# EAGLE design Bears_and_Bears_BLE_soil_Moisture_Sensor (EAGLE 9.1.0)

## Sheet 1 of 2
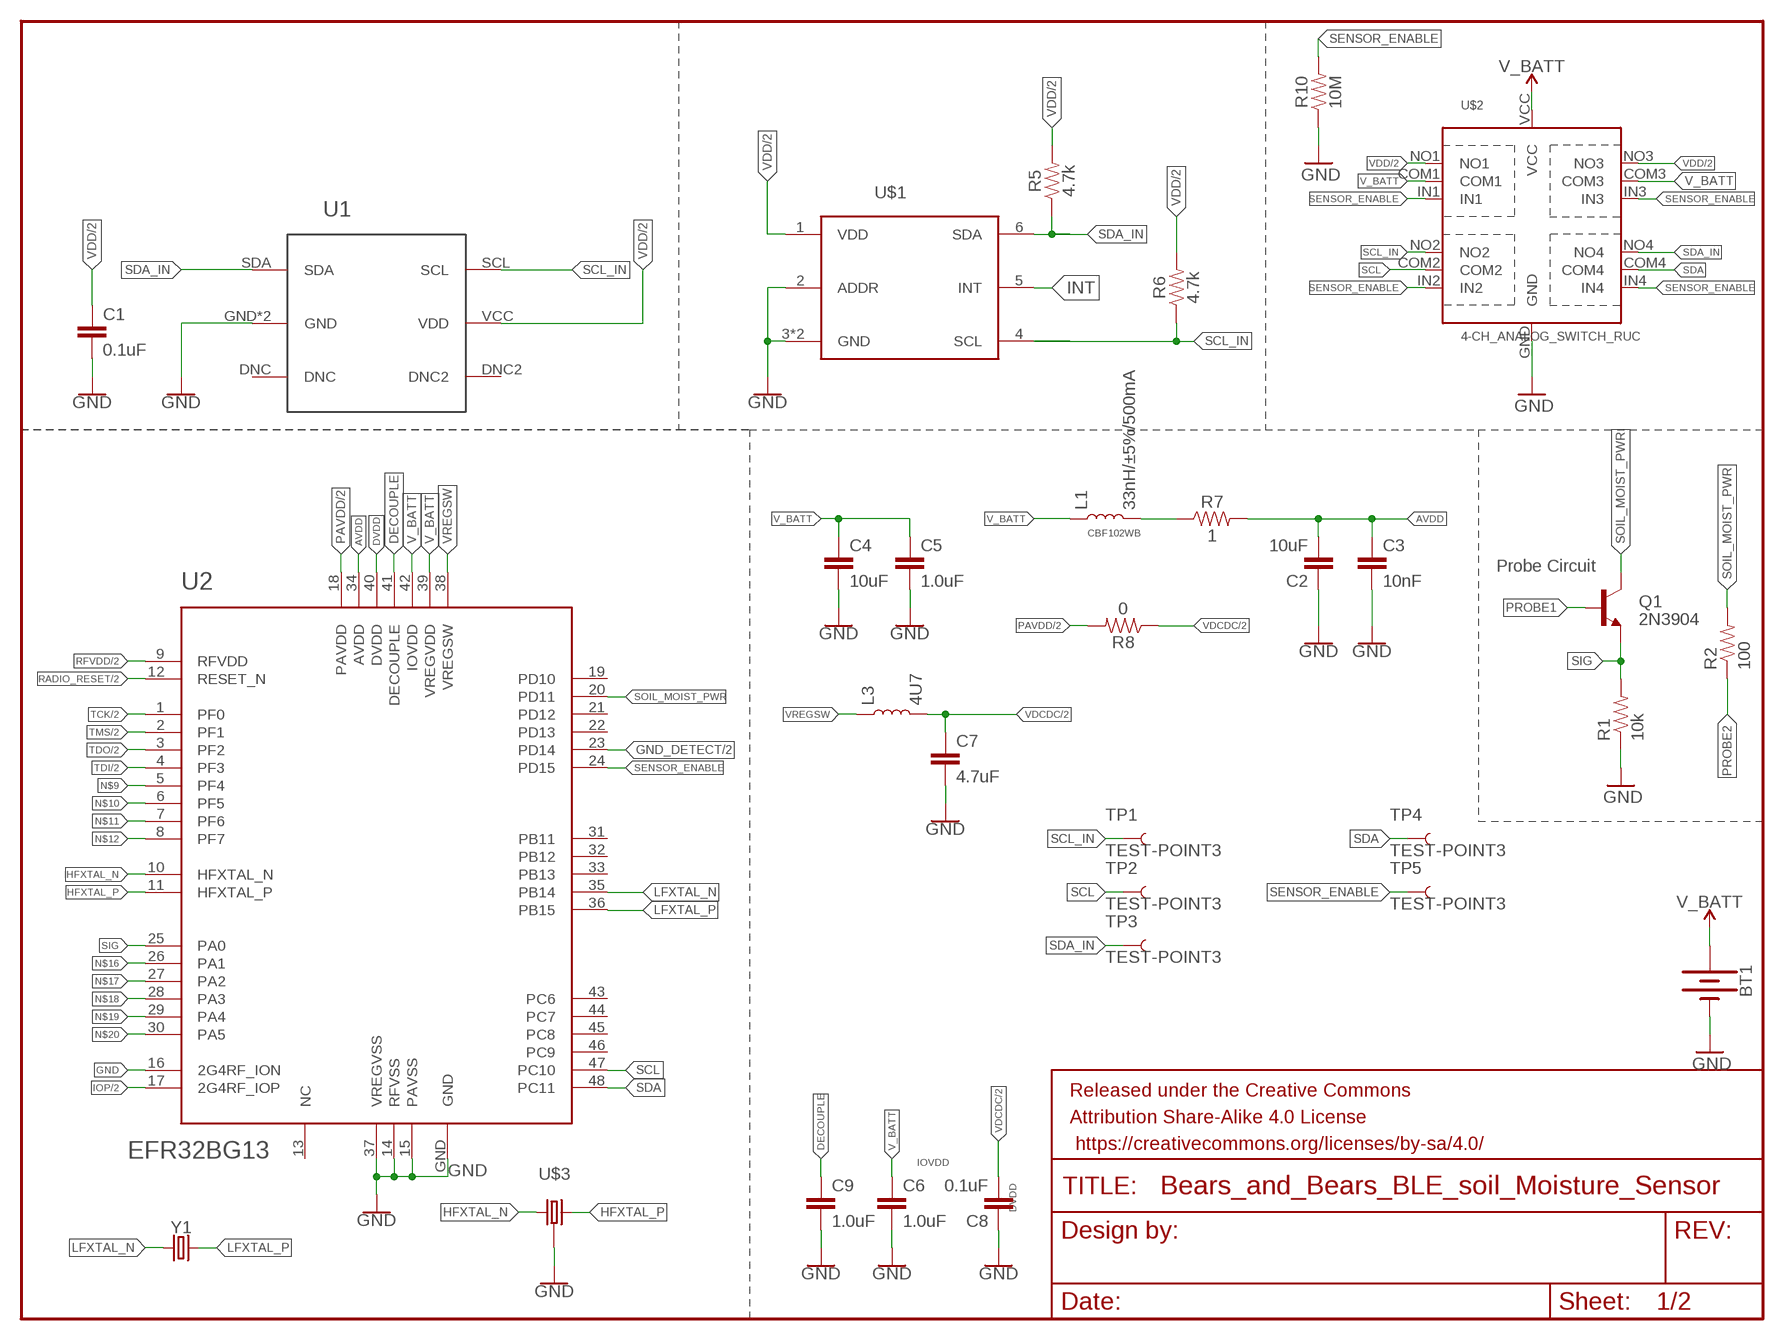
[diagram p0: schematic, sheet 1]

### Parts
BT1  BATTERY-20MM_SMD_4LEGS_OVERPASTE  [BATTCON_20MM_4LEGS_OVERPASTE]
C1  0.1uF  0.1UF-0603-25V-(+80/-20%)  [0603]
C2  10uF  10UF-0603-6.3V-20%  [0603]
C3  10nF  10NF-0603-50V-10%  [0603]
C4  10uF  10UF-0603-6.3V-20%  [0603]
C5  1.0uF  1.0UF-0603-16V-10%  [0603]
C6  1.0uF  1.0UF-0603-16V-10%  [0603]
C7  4.7uF  4.7UF0603  [0603]
C8  0.1uF  0.1UF-0603-25V-(+80/-20%)  [0603]
C9  1.0uF  1.0UF-0603-16V-10%  [0603]
FRAME1  FRAME-LETTER  [CREATIVE_COMMONS]
L1  33nH/±5%/500mA  INDUCTOR-0603-33NH  [0603]
L3  4U7  [1212(3030METRIC)]
Q1  2N3904  TRANSISTOR_NPNMMBT2222A  [SOT23-3]
R1  10k  100OHM-1/4W-5%(0603)  [0603-RES]
R2  100  100OHM-1/4W-5%(0603)  [0603-RES]
R5  4.7k  4.7KOHM-0603-1/10W-1%  [0603]
R6  4.7k  4.7KOHM-0603-1/10W-1%  [0603]
R7  1  1OHM-0603-1/10W-1%  [0603]
R8  0  0OHM-0603-1/10W-5%  [0603]
R10  10M  10MOHM-0603-1/10W-5%  [0603]
TP1  TEST-POINT3  [PAD.03X.03]
TP2  TEST-POINT3  [PAD.03X.03]
TP3  TEST-POINT3  [PAD.03X.03]
TP4  TEST-POINT3  [PAD.03X.03]
TP5  TEST-POINT3  [PAD.03X.03]
U1  SI7021_TEMP_HUMIDTY  [DFN-6]
U2  EFR32BG13  [QFN48]
U$1  OPT3001DNPT  [6PIN_USON]
U$2  4-CH_ANALOG_SWITCH_RUC  [PX2QFN14_RUC]
U$3  38.4MHZ_CRYSTAL  [2.0X1.6]
Y1  32.768KHZ_LOW_FREQ_CRYSTAL  [CRYSTAL_1.2X0.6]

### Nets
AVDD: C2.2 C3.1 R7.2 U2.34(AVDD)
DECOUPLE: C9.1 U2.41(DECOUPLE)
DVDD: U2.40(DVDD)
GND: BT1.2(-) C1.2 C2.1 C3.2 C4.2 C5.2 C6.2 C7.2 C8.1 C9.2 R1.1 R10.1 U1.GND U1.GND2(GND) U2.14(RFVSS) U2.15(PAVSS) U2.16(2G4RF_ION) U2.37(VREGVSS) U2.GND U$1.2(ADDR) U$1.3(GND) U$1.GND U$2.GND U$3.GND U$3.GND2(GND) ; also sheet 2
GND_DETECT: U2.23(PD14) ; also sheet 2
HFXTAL_N: U2.10(HFXTAL_N) U$3.1
HFXTAL_P: U2.11(HFXTAL_P) U$3.3
INT: U$1.5(INT)
IOP: U2.17(2G4RF_IOP) ; also sheet 2
LFXTAL_N: U2.35(PB14) Y1.P$1
LFXTAL_P: U2.36(PB15) Y1.P$2
N$9: U2.5(PF4)
N$10: U2.6(PF5)
N$11: U2.7(PF6)
N$12: U2.8(PF7)
N$16: U2.26(PA1)
N$17: U2.27(PA2)
N$18: U2.28(PA3)
N$19: U2.29(PA4)
N$20: U2.30(PA5)
N$49: L1.2 R7.1
PAVDD: R8.2 U2.18(PAVDD) ; also sheet 2
PROBE1: Q1.1(B)
PROBE2: R2.1
RADIO_RESET: U2.12(RESET_N) ; also sheet 2
RFVDD: U2.9(RFVDD) ; also sheet 2
SCL: TP2.P$1 U2.47(PC10) U$2.COM2
SCL_IN: R6.1 TP1.P$1 U1.SCL U$1.4(SCL) U$2.NO2
SDA: TP4.P$1 U2.48(PC11) U$2.COM4
SDA_IN: R5.1 TP3.P$1 U1.SDA U$1.6(SDA) U$2.NO4
SENSOR_ENABLE: R10.2 TP5.P$1 U2.24(PD15) U$2.IN1 U$2.IN2 U$2.IN3 U$2.IN4
SIG: Q1.2(E) R1.2 U2.25(PA0)
SOIL_MOIST_PWR: Q1.3(C) R2.2 U2.20(PD11)
TCK: U2.1(PF0) ; also sheet 2
TDI: U2.4(PF3) ; also sheet 2
TDO: U2.3(PF2) ; also sheet 2
TMS: U2.2(PF1) ; also sheet 2
V_BATT: BT1.1(+) C4.1 C5.1 C6.1 L1.1 U2.39(VREGVDD) U2.42(IOVDD) U$2.COM1 U$2.COM3 U$2.VCC
VDCDC: C7.1 C8.2 L3.P$2 R8.1 ; also sheet 2
VDD: C1.1 R5.2 R6.2 U1.VCC(VDD) U$1.1(VDD) U$2.NO1 U$2.NO3 ; also sheet 2
VREGSW: L3.P$1 U2.38(VREGSW)
Unconnected: U1.DNC U1.DNC2 U2.13(NC) U2.19(PD10) U2.21(PD12) U2.22(PD13) U2.31(PB11) U2.32(PB12) U2.33(PB13) U2.43(PC6) U2.44(PC7) U2.45(PC8) U2.46(PC9)

### Notes on the sheet
- CBF102WB
- Probe Circuit
- IOVDD
- DVDD

## Sheet 2 of 2
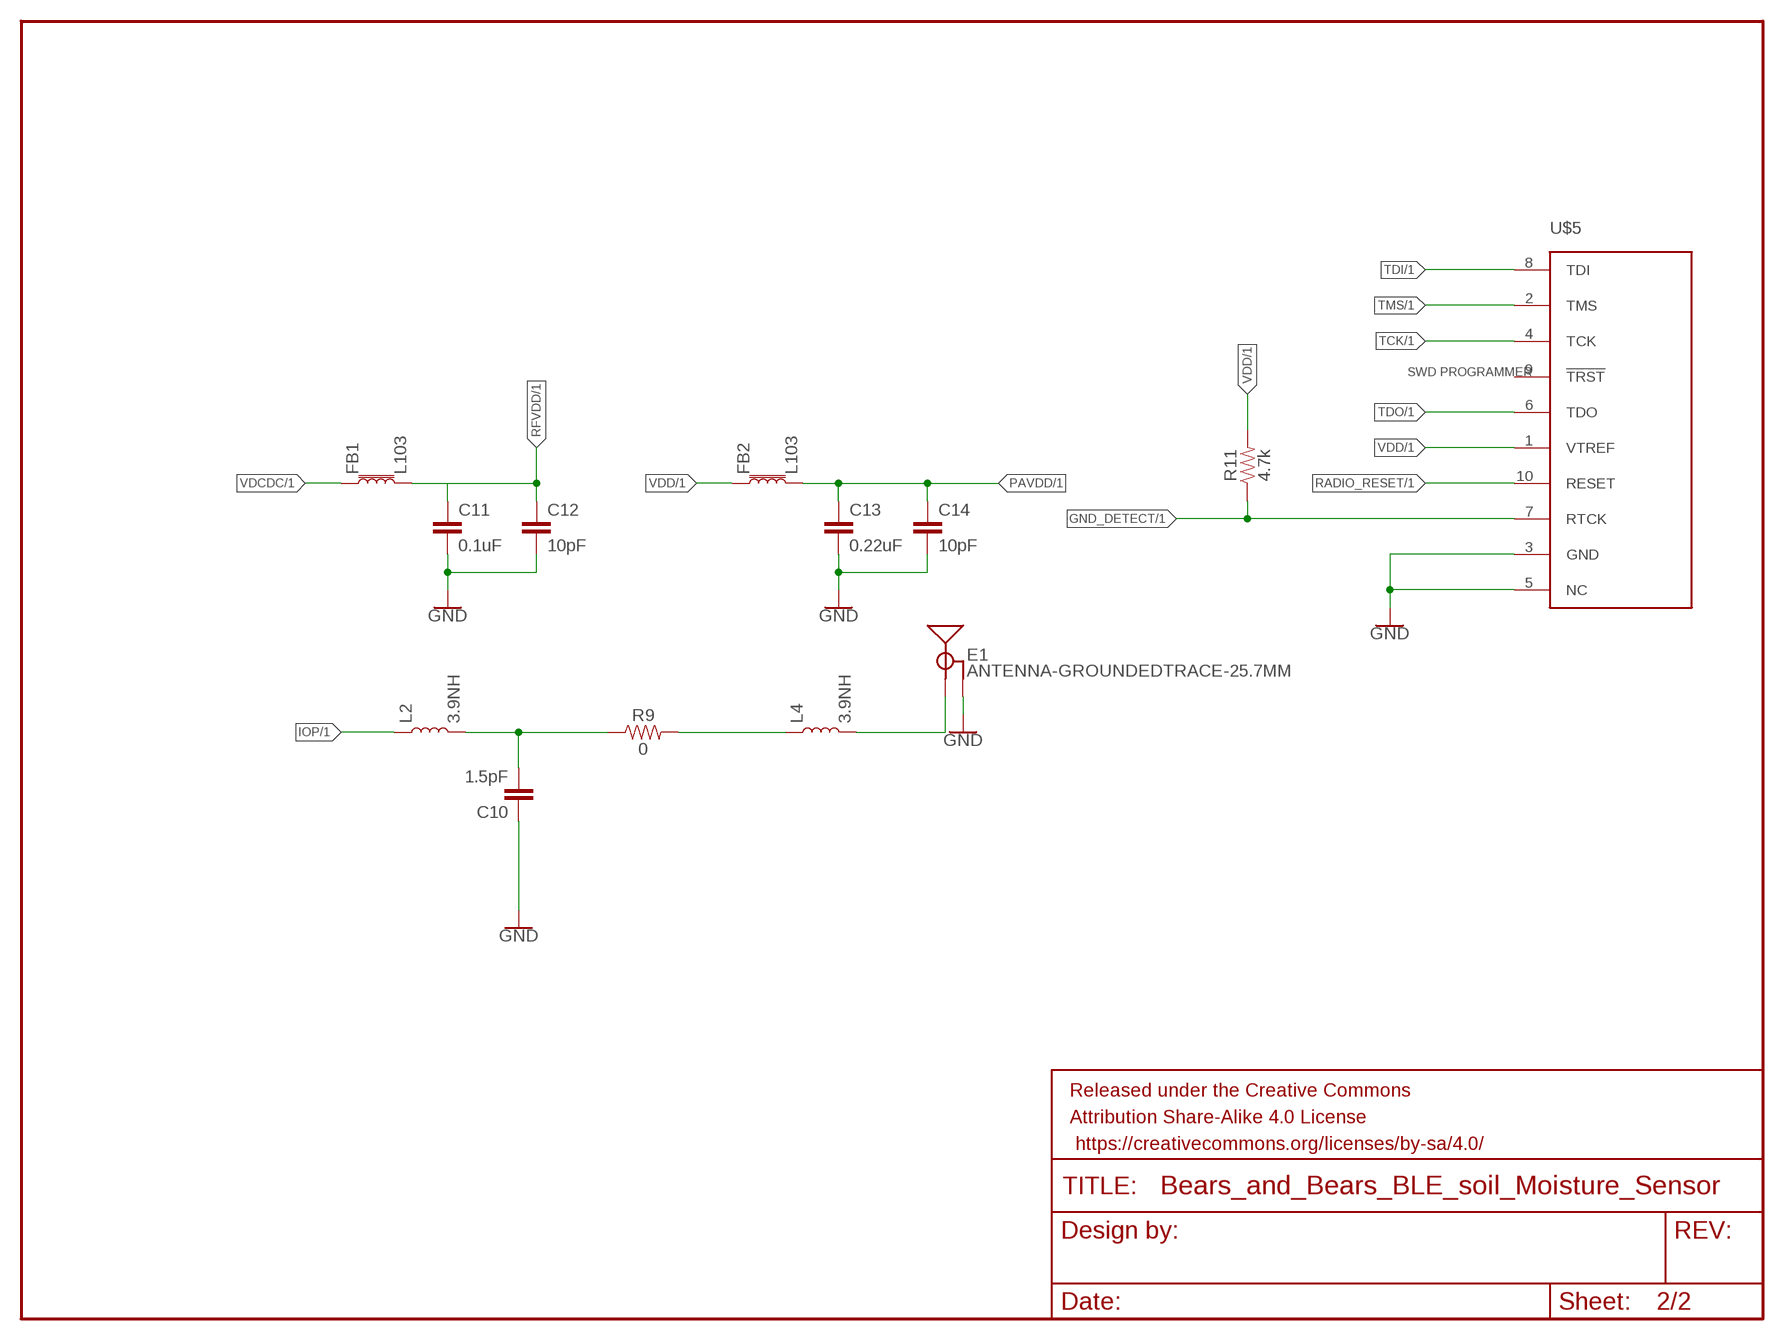
[diagram p1: schematic, sheet 2]

### Parts
C10  1.5pF  1.5PF-0603-50V-16.667%  [0603]
C11  0.1uF  0.1UF-0603-25V-(+80/-20%)  [0603]
C12  10pF  10PF-0603-50V-5%  [0603]
C13  0.22uF  0.22UF-0603-25V-10%  [0603]
C14  10pF  10PF-0603-50V-5%  [0603]
E1  ANTENNA-GROUNDEDTRACE-25.7MM  [TRACE_ANTENNA_2.4GHZ_25.7MM]
FB1  L103  FERRITE_BEAD-0603  [0603]
FB2  L103  FERRITE_BEAD-0603  [0603]
FRAME2  FRAME-LETTER  [CREATIVE_COMMONS]
L2  3.9NH  INDUCTOR-0402-3.9NH  [0402]
L4  3.9NH  INDUCTOR-0402-3.9NH  [0402]
R9  0  0.22OHM-0805-1/4W-1%  [0805]
R11  4.7k  4.7KOHM-0603-1/10W-1%  [0603]
U$5  TC2050-MCP-NL  [TC2030-MCP-NL]

### Nets
GND: C10.1 C11.2 C12.2 C13.2 C14.2 E1.GND E1.GND2(GND) U$5.3(GND) U$5.5(NC) ; also sheet 1
GND_DETECT: R11.1 U$5.7(RTCK) ; also sheet 1
IOP: L2.1 ; also sheet 1
N$3: C10.2 L2.2 R9.1
N$23: L4.1 R9.2
N$26: E1.ANT(SIGNAL) L4.2
PAVDD: C13.1 C14.1 FB2.2 ; also sheet 1
RADIO_RESET: U$5.10(RESET) ; also sheet 1
RFVDD: C11.1 C12.1 FB1.2 ; also sheet 1
TCK: U$5.4(TCK) ; also sheet 1
TDI: U$5.8(TDI) ; also sheet 1
TDO: U$5.6(TDO) ; also sheet 1
TMS: U$5.2(TMS) ; also sheet 1
VDCDC: FB1.1 ; also sheet 1
VDD: FB2.1 R11.2 U$5.1(VTREF) ; also sheet 1
Unconnected: U$5.9(!TRST)

### Notes on the sheet
- SWD PROGRAMMER

## Library data of the parts
BT1 = SparkFun-Batteries:BATTERY: Battery - Single Cell A variety of battery chemistries, sizes, and footprints. Device List: 20MM_PTH - Coin Cell Battery Holder - 20mm (PTH) <https://www.sparkfun.com/products/783> 6.8MM_PTH - Coin Cell Battery Holder - 6.8MM(SMD) <https://www.digikey.com/product-detail/en/seiko-instruments/MS621FE-FL11E/728-1057-ND/1889208?WT.srch=1&gclid=CNOQ5a6LzdQCFZS2wAodXCkE0g> 12MM_SMD - Coin Cell Battery Holder - 12mm (SMD) <https://www.sparkfun.com/products/10592> 12MM_PTH - Coin Cell Battery Holder - 12mm (PTH) <https://www.sparkfun.com/products/7948> 20MM_SMD - 20mm Coin Cell Battery Holder (SMD) (2 legs) Used on the Big Time Watch Kit <https://www.sparkfun.com/products/11734> 20MM_SMD_4LEGS - Coin Cell Battery Holder - 20mm (SMD) <https://www.sparkfun.com/products/11892> 20MM_SMD_4LEGS_OVERPASTE - Coin Cell Battery Holder - 20mm (SMD) <https://www.sparkfun.com/products/11892> (Over-paste on the legs) 24.5MM_PTH - Coin Cell Battery Holder - 24.5mm (PTH) <https://www.sparkfun.com/products/8863> 9V - 9V Battery Holder - PC Mount Used on the SparkFun SparkPunk Sound Kit <https://www.sparkfun.com/products/11177> and SparkFun SparkPunk Sequencer Kit <https://www.sparkfun.com/products/12707> 18650 - Battery Holder - 18650 (PTH) <https://www.sparkfun.com/products/13113> AA - Battery Holder - 1xAA (PTH) <https://www.sparkfun.com/products/7949> AAA - Battery Holder - 1xAAA (PTH) <https://www.sparkfun.com/products/12718> AA_KIT - Battery Holder - 1xAA (PTH) <https://www.sparkfun.com/products/7949> Special kit package - pads only have exposed copper on one side of the board. AAA_KIT - Battery Holder - 1xAAA (PTH) <https://www.sparkfun.com/products/12718> Special kit package - pads only have exposed copper on one side of the board.; PROD_ID: PRT-11892; SF_SKU: BATT-10373
C1 C8 C11 = SparkFun-Capacitors:0.1UF: 0.1µF ceramic capacitors A capacitor is a passive two-terminal electrical component used to store electrical energy temporarily in an electric field.; PROD_ID: CAP-00810
C2 C4 = SparkFun-Capacitors:10UF: 10.0µF ceramic capacitors A capacitor is a passive two-terminal electrical component used to store electrical energy temporarily in an electric field.; PROD_ID: CAP-11015
C3 = SparkFun-Capacitors:10NF: 0.01uF/10nF/10,000pF ceramic capacitors A capacitor is a passive two-terminal electrical component used to store electrical energy temporarily in an electric field. CAP-09321; PROD_ID: CAP-00867
C5 C6 C9 = SparkFun-Capacitors:1.0UF: 1µF ceramic capacitors A capacitor is a passive two-terminal electrical component used to store electrical energy temporarily in an electric field.; PROD_ID: CAP-00868
C7 = SparkFun-Capacitors:4.7UF: 4.7µF ceramic capacitors A capacitor is a passive two-terminal electrical component used to store electrical energy temporarily in an electric field.; PROD_ID: CAP-08280
C10 = SparkFun-Capacitors:1.5PF: 1.5pF ceramic capacitors A capacitor is a passive two-terminal electrical component used to store electrical energy temporarily in an electric field.; PROD_ID: CAP-08763
C12 C14 = SparkFun-Capacitors:10PF: 10pF ceramic capacitors A capacitor is a passive two-terminal electrical component used to store electrical energy temporarily in an electric field.; PROD_ID: CAP-11812
C13 = SparkFun-Capacitors:0.22UF: 0.22µF ceramic capacitors A capacitor is a passive two-terminal electrical component used to store electrical energy temporarily in an electric field.; PROD_ID: CAP-07822
E1 = SparkFun-RF:ANTENNA-GROUNDED: Antenna w/ Ground Connection 2.4GHz antennae with signal and ground terminals. TRACE_ANTENNA_2.4GHZ_15.2MM - Meander Trace antenna 15.2 x 5.7mm footprint Based on layout from TI app note AN043 <http://www.ti.com/lit/an/swra117d/swra117d.pdf>. TRACE_ANTENNA_2.4GHZ_25.7MM - Inverted F trace antenna 25.7 x 7.5 mm footprint. Based on layout from TI design note DN0007 <http://www.ti.com/lit/an/swru120b/swru120b.pdf>.
FB1 FB2 = SparkFun-Coils:FERRITE_BEAD: Ferrite Bead (blocks, cores, rings, chokes, etc.) Inductor with layers of ferrite used to suppress high frequencies. Often used to isolate high frequency noise. SparkFun Products: IOIO-OTG - V2.2 <https://www.sparkfun.com/products/13613> SparkFun SAMD21 Mini Breakout <https://www.sparkfun.com/products/13664> SparkFun 6 Degrees of Freedom Breakout - LSM6DS3 <https://www.sparkfun.com/products/13339> SparkFun SAMD21 Dev Breakout <https://www.sparkfun.com/products/13672>; PROD_ID: NDUC-13805; VALUE: 30Ω/1.8A
FRAME1 FRAME2 = SparkFun-Aesthetics:FRAME-LETTER: Schematic Frame - Letter Standard 8.5x11 US Letter frame
L1 = SparkFun-Coils:INDUCTOR: Inductors Resist changes in electrical current. Basically a coil of wire. SparkFun Products: SparkFun Load Cell Amplifier - HX711 <https://www.sparkfun.com/products/13879> IOIO-OTG - V2.2 <https://www.sparkfun.com/products/13613>; PROD_ID: NDUC-07874
L2 L4 = SparkFun-Coils:INDUCTOR: Inductors Resist changes in electrical current. Basically a coil of wire. SparkFun Products: SparkFun Load Cell Amplifier - HX711 <https://www.sparkfun.com/products/13879> IOIO-OTG - V2.2 <https://www.sparkfun.com/products/13613>; PROD_ID: NDUC-13457
L3 = 4.7UH:4U7
Q1 = SparkFun-DiscreteSemi:TRANSISTOR_NPN: Generic NPN BJT MMBT2222A - TRANS-08049 (SOT-23, 1A 40V) MPSA42 - TRANS-09116 (SOT-23, 500mA 300V) MMBT5088LT1G - TRANS-11160 (SOT-23, 50 mA 30V) BC547 - COM-08928 <http://www.sparkfun.com/products/8928> (TO-92 45V 100mA) (1.Collector 2.Base 3.Emitter) 2N3904 - COM-00521 <http://www.sparkfun.com/products/521> (TO-92 40V 200mA) (1.Emitter 2.Base 3.Collector) P2N2222A - COM-12852 <http://www.sparkfun.com/products/12852> (TO-92 40V 600mA) (1.Collector 2.Base 3.Emitter); PROD_ID: TRANS-08049; VALUE: MMBT2222A
R1 R2 = SparkFun-Resistors:100OHM-1/4W-5%(0603); PROD_ID: RES-12438; VALUE: 100/.25W
R5 R6 R11 = SparkFun-Resistors:4.7KOHM: 4.7kΩ resistor A resistor is a passive two-terminal electrical component that implements electrical resistance as a circuit element. Resistors act to reduce current flow, and, at the same time, act to lower voltage levels within circuits. - Wikipedia; PROD_ID: RES-07857
R7 = SparkFun-Resistors:1OHM: 1Ω resistor A resistor is a passive two-terminal electrical component that implements electrical resistance as a circuit element. Resistors act to reduce current flow, and, at the same time, act to lower voltage levels within circuits. - Wikipedia; PROD_ID: RES-08269
R8 = SparkFun-Resistors:0OHM: 0Ω resistor A resistor is a passive two-terminal electrical component that implements electrical resistance as a circuit element. Resistors act to reduce current flow, and, at the same time, act to lower voltage levels within circuits. - Wikipedia; PROD_ID: RES-08609
R9 = SparkFun-Resistors:0.22OHM: 0.22Ω resistor A resistor is a passive two-terminal electrical component that implements electrical resistance as a circuit element. Resistors act to reduce current flow, and, at the same time, act to lower voltage levels within circuits. - Wikipedia; PROD_ID: RES-09883; VALUE: 0.22
R10 = SparkFun-Resistors:10MOHM: RES-09327; PROD_ID: RES-08283
TP1-TP5 = SparkFun-Connectors:TEST-POINT: SparkFun Test Points Bare copper test points for troubleshooting or In-Circuit-Testing. These are used by our Production team for verifying production board runs using pogo-pins on test beds. SparkFun Products: SparkFun LSM9DS1 Breakout <https://www.sparkfun.com/products/13284> SparkFun PSOC <https://www.sparkfun.com/products/13714> SparkFun Load Cell Amplifier <https://www.sparkfun.com/products/13879>
U1 = Si7021_A20:SI7021_TEMP_HUMIDTY
U2 = EFR32BG13:EFR32BG13
U$1 = ALS_OPT3001:OPT3001DNPT
U$2 = 4chAnalogSwitch:4-CH_ANALOG_SWITCH_RUC
U$3 = Crystal_SMD_2.0x1.6:38.4MHZ_CRYSTAL
U$5 = TC2050:TC2050: TAG-CONNECT ISP Connector Manufacturer: Tag-Connect <www.tag-connect.com> Cable for easy In-Circuit PCB Programming. Designed for JTAG 10 pin, suitable for many others. Pin Connection for TC2050 NL. PAD Description 1 VTREF 2 TMS 3 GND 4 TCK 5 NC 6 TDO 7 RTCK 8 TDI 9 !TRST 10 RESET ©2009 ROFA.cz Modified 7/2011 by Tim McCarthy-Smith VIDA Products INC
Y1 = Crystal_SMD_1.2x0.6:32.768KHZ_LOW_FREQ_CRYSTAL

## Board
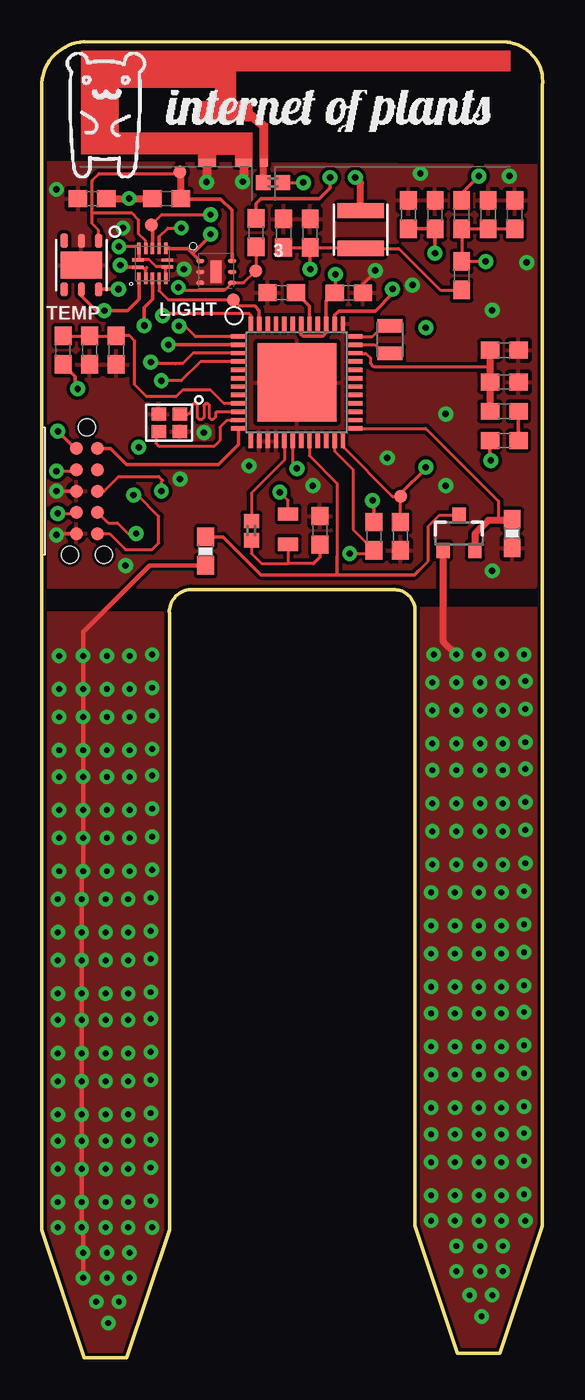
[diagram p2: board, top side]
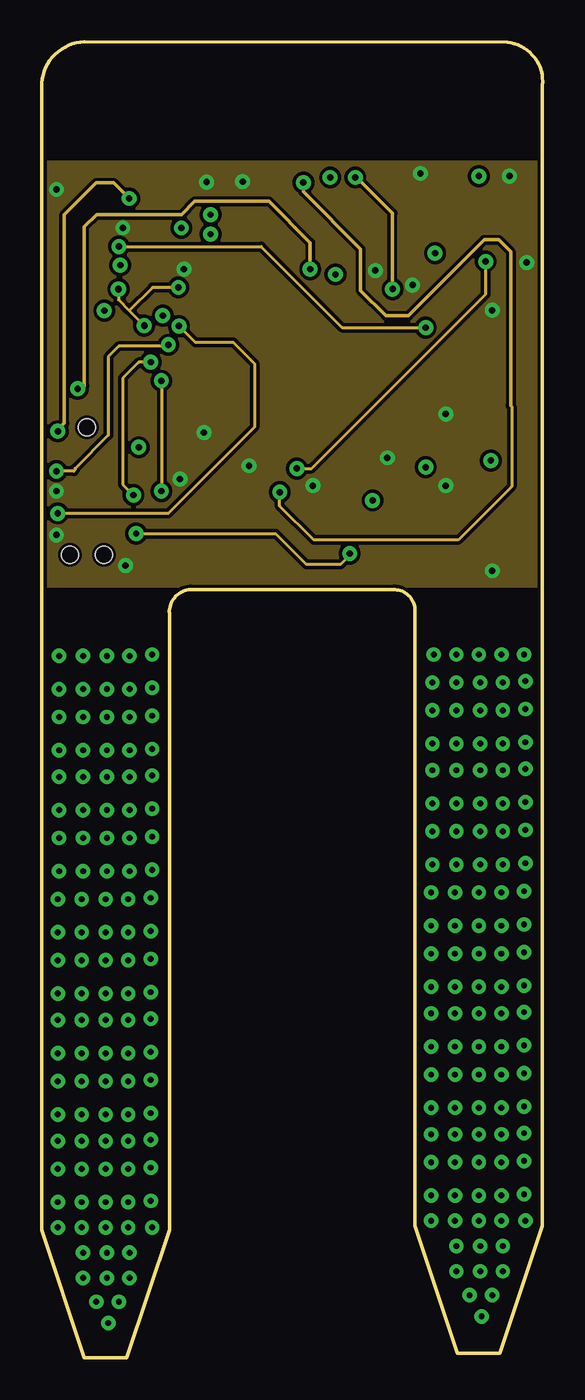
[diagram p3: board, inner layer Route2]
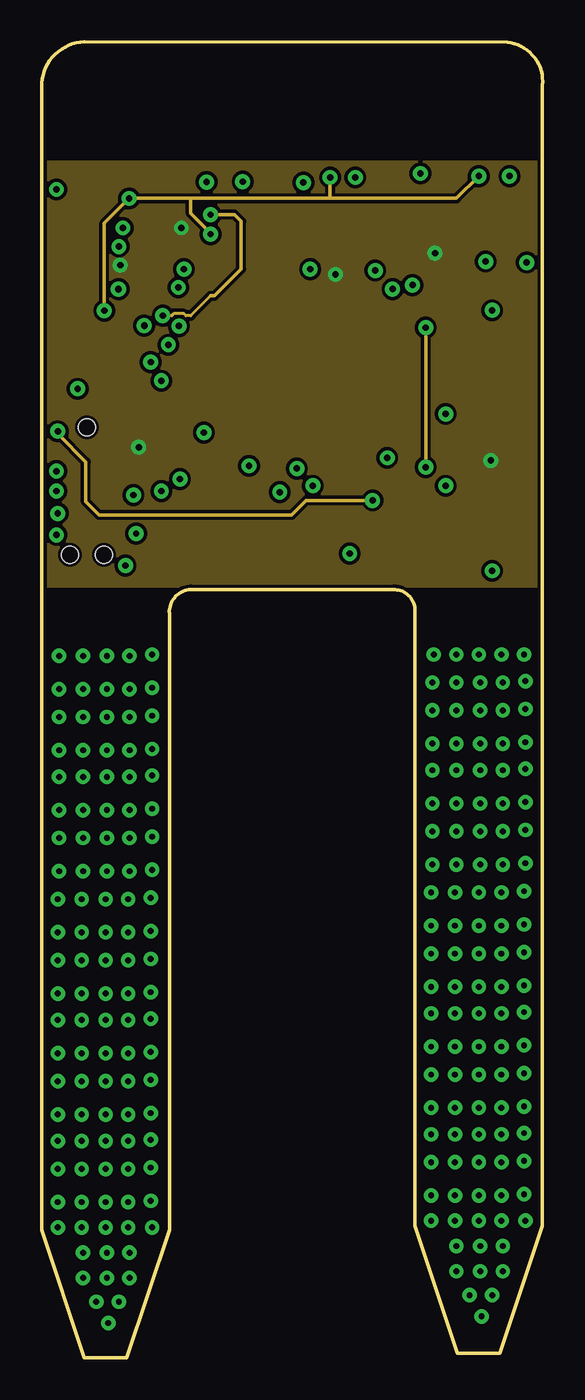
[diagram p4: board, inner layer Route15]
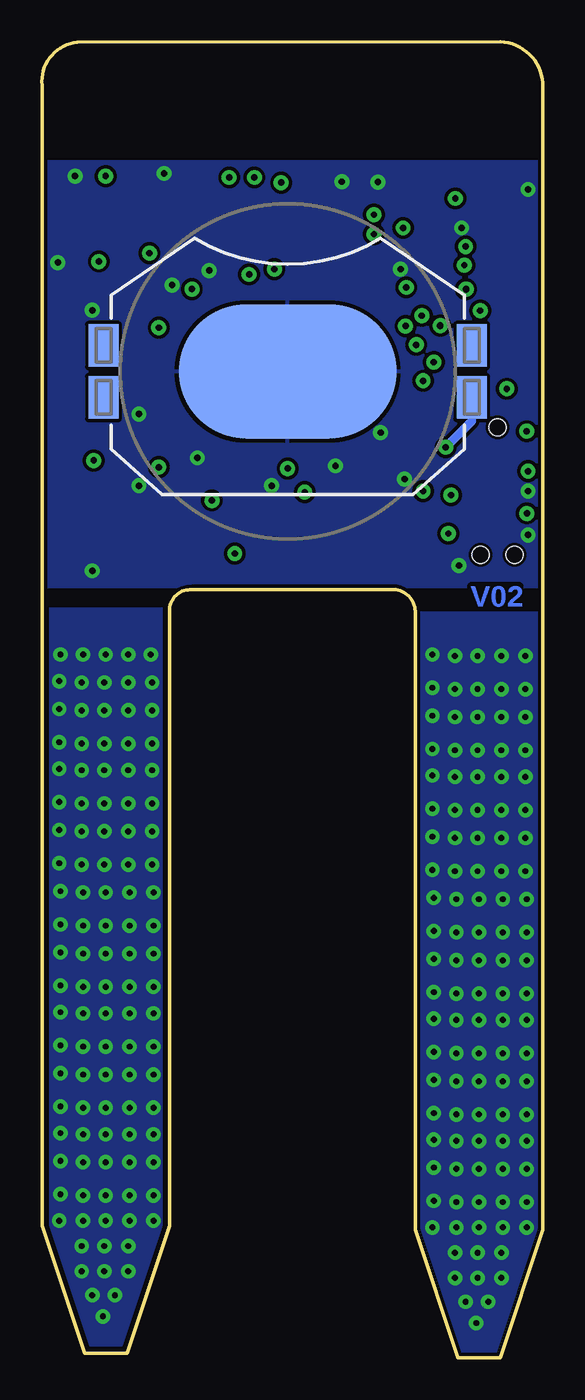
[diagram p5: board, bottom side, seen from below]

Size 29.93 x 78.58 mm. Coordinates in mm from the lower left corner, seen from the top.
Outline: 2.54,78.58 arc90 0,75.88 0,7.62 2.54,0 5.08,0 7.62,7.62 7.62,44.45 arc-90 8.89,45.88 20.97,45.86 arc-90 22.3,44.72 22.3,7.89 24.84,0.27 27.38,0.27 29.92,7.89 29.92,75.99 arc90 27.8,78.56 2.54,78.58
Copper layers (1*2*15*16): Top 0.035559375mm / dielectric 0.47751875mm / Route2 0.035559375mm / dielectric 0.47751875mm / Route15 0.035559375mm / dielectric 0.47751875mm / Bottom 0.035559375mm
Design rules "SparkFun-2-layer *": minimum track width 7mil, minimum drill 15mil, track to track 8mil, track to pad 8mil, pad to pad 8mil, via to via 8mil, smd to smd 8mil, copper to edge 8mil, drill to drill 8mil, minimum pad ring 12mil, minimum via ring 10mil, stop-mask expansion 4mil, vias tented up to drill 20mil, thermal gap 10mil

### Footprints (pad centres in the part's own frame; a part is rotated, then mirrored left to right if it is on the bottom)
BATTCON_20MM_4LEGS_OVERPASTE = smd 1.778 x 2.54: 1 -11,1.55; 3 11,1.55; P$1 -11,-1.55; P$2 11,-1.55 | smd 13 x 8: 2 0,0
0603 = smd 1.1 x 1: 1 -0.85,0; 2 0.85,0
TRACE_ANTENNA_2.4GHZ_25.7MM = smd 0.46 x 0.46: ANT 0,0.23 | smd 1 x 0.46: GND -1.18,0.23; GND2 -3.38,0.23
0402 = smd 0.85 x 0.9: 1 -0.58,0; 2 0.58,0
1212(3030METRIC) = smd 0.9 x 2.8: P$1 -1.025,0; P$2 1.225,0
SOT23-3 = smd 0.8 x 0.9: 1 -0.95,-1; 2 0.95,-1; 3 0,1.1
0603-RES = smd 1.1 x 1: 1 -0.85,0; 2 0.85,0
0805 = smd 0.8 x 1.2: 1 -0.9,0; 2 0.9,0
PAD.03X.03 = smd 0.762 x 0.762: P$1 0,0
DFN-6 = smd 0.85 x 0.45: DNC -1.462,-1.023; DNC2 1.438,-1.023; GND2 -1.45,0; SCL 1.442,1.027; SDA -1.45,1.024; VCC 1.444,0.003 | smd 1.6 x 2.5: GND 0,0
QFN48 = smd 0.86 x 0.26: 1 -3.5,4; 2 -3.5,3.5; 3 -3.5,3; 4 -3.5,2.5; 5 -3.5,2; 6 -3.5,1.5; 7 -3.5,1; 8 -3.5,0.5; 9 -3.5,0; 10 -3.5,-0.5; 11 -3.5,-1; 12 -3.5,-1.5; 25 3.5,-1.5; 26 3.5,-1; 27 3.5,-0.5; 28 3.5,0; 29 3.5,0.5; 30 3.5,1; 31 3.5,1.5; 32 3.5,2; 33 3.5,2.5; 34 3.5,3; 35 3.5,3.5; 36 3.5,4 | smd 0.26 x 0.86: 13 -2.75,-2.25; 14 -2.25,-2.25; 15 -1.75,-2.25; 16 -1.25,-2.25; 17 -0.75,-2.25; 18 -0.25,-2.25; 19 0.25,-2.25; 20 0.75,-2.25; 21 1.25,-2.25; 22 1.75,-2.25; 23 2.25,-2.25; 24 2.75,-2.25; 37 2.75,4.75; 38 2.25,4.75; 39 1.75,4.75; 40 1.25,4.75; 41 0.75,4.75; 42 0.25,4.75; 43 -0.25,4.75; 44 -0.75,4.75; 45 -1.25,4.75; 46 -1.75,4.75; 47 -2.25,4.75; 48 -2.75,4.75 | smd 4.7 x 4.7: GND 0,1.25
6PIN_USON = smd 0.5 x 0.25: 1 0.1,1.625; 2 0.1,0.975; 3 0.1,0.325; 4 2,0.325; 5 2,0.975; 6 2,1.625 | smd 0.65 x 1.35: GND 1.05,0.975
PX2QFN14_RUC = smd 0.2 x 0.68: COM1 0.65,0.15; COM2 1.45,0.15; COM3 1.45,1.95; COM4 1.05,1.95; IN2 1.85,0.15; IN4 0.25,1.95; NO1 0.25,0.15; NO2 1.05,0.15; NO3 1.85,1.95; NO4 0.65,1.95 | smd 0.68 x 0.2: GND 1.95,1.25; IN1 0.175,1.275; IN3 1.95,0.85; VCC 0.175,0.825
2.0X1.6 = smd 0.875 x 0.775: 1 1.26,0; 3 0,-1.04; GND 0,0; GND2 1.26,-1.04
TC2030-MCP-NL = smd 0.787 x 0.787: 1 1.27,-0.635; 2 2.54,-0.635; 3 3.81,-0.635; 4 5.08,-0.635; 5 6.35,-0.635; 6 6.35,0.635; 7 5.08,0.635; 8 3.81,0.635; 9 2.54,0.635; 10 1.27,0.635 | hole 1: 0,0; 7.62,-1.016; 7.62,1.016
CRYSTAL_1.2X0.6 = smd 0.8 x 1.5: P$1 -0.825,0; P$2 0.825,0

### Placement (x,y rotation side)
BT1  15.24,58.9 180 bottom
C1  3.02,69.22 180 top
C2  27.62,60.17 180 top
C3  27.62,58.26 0 top
C4  23.49,68.26 90 top
C5  21.91,68.26 90 top
C6  18.34,63.59 0 top
C7  16.03,67.15 90 top
C8  14.45,67.15 270 top
C9  14.34,63.61 180 top
C10  16.61,49.41 270 top
C11  2.86,60.17 270 top
C12  4.45,60.17 270 top
C13  26.67,68.26 90 top
C14  28.26,68.26 90 top
E1  13.25,71.14 0 top
FB1  1.27,60.17 90 top
FB2  25.08,68.26 270 top
FRAME1  20.32,-8.89 0 top  (outside the outline)
FRAME2  20.32,-8.89 0 top  (outside the outline)
L1  27.62,54.77 0 top
L2  12.52,49.39 270 top
L3  19.05,67.47 270 top
L4  13.81,70.17 180 top
Q1  24.92,49.21 0 top
R1  28.1,49.21 90 top
R2  9.79,48.16 90 top
R5  7.46,69.22 180 top
R6  12.8,67.18 90 top
R7  27.62,56.52 180 top
R8  25.08,64.61 90 top
R9  14.72,49.48 90 top
R10  21.43,49.05 90 top
R11  19.84,49.05 90 top
TP1  12.79,64.91 0 top
TP2  11.44,63.17 0 top
TP3  8.26,70.8 0 top
TP4  6.56,67.65 0 top
TP5  21.43,51.43 0 top
U1  2.37,65.25 270 top
U2  15.24,56.99 0 top
U$1  9.37,63.87 0 top
U$2  5.56,64.29 0 top
U$3  6.98,56.36 0 top
U$4  [CAPTURE#PNG]  3.89,74.22 0 top
U$5  2.7,55.56 270 top
U$6  [INTERNET_OF_PLANTS0]  6.11,74.45 0 top
Y1  20.8,60.8 90 top

### Tracks (layer width: path | path; a pad name or v marks a point on that pad's centre or on a via)
AVDD
  Top 0.178: U2.34 18.76,59.98 19.36,59.98 19.62,59.71 19.62,59.4 19.82,59.2 26.69,59.2 26.77,59.11
  Top 0.406: C2.2 26.77,59.11 C3.1 R7.2
DECOUPLE
  Top 0.203: U2.41 15.99,62.81 C9.1
GND  (via drill 0.38)
  Top 0.203: U$5.3 v0.87,51.75 | U$5.5 0.95,49.21 v0.87,49.13 | C6.2 19.19,64.11 19.84,64.77 19.84,64.85 v19.92,64.93
  Top 0.508: E1.GND2 9.87,70.24 v9.84,70.21 | E1.GND 12.07,70.3 v12,70.23
  other vias: 12.38,53.26 4.84,67.47 0.87,69.77 9.68,55.24 16.19,52.07 8.49,65.01 8.26,52.47 20.64,53.74 5,47.31 24.13,52.07 24.13,56.36 26.91,46.99 22.62,70.72 27.94,70.56 28.97,65.41 22.15,64.06 26.91,62.55
  pour Top: -0.1,71.44 -0.1,46.4 0.3,46 29.5,46 29.9,46.4 29.9,71.21 29.5,71.52 29.81,71.21
  pour Route2: 0,71.44 29.84,71.44 29.84,46.04 0,46.04
  pour Bottom: 0,71.44 29.84,71.44 29.84,46.04 0,46.04
GND_DETECT  (via drill 0.38)
  Top 0.178: U2.23 17.49,54.13 18.59,53.03 18.59,49.46 R11.1 19.66,48.02 v18.39,48.02 | U$5.7 3.97,49.85 4.52,49.85 5.16,49.21 v5.64,49.21
  Route2 0.178: v5.64,49.21 13.97,49.21 15.8,47.39 17.86,47.39 18.49,48.02 v18.39,48.02
HFXTAL_N
  Top 0.178: U$3.1 8.65,56.36 arc90 8.97,56.67 8.97,56.83 arc-90 9.13,56.99 arc-90 9.29,56.83 9.29,56.2 arc90 9.45,56.04 9.52,56.04 arc90 9.68,56.2 9.68,56.83 arc-90 9.84,56.99 arc-90 10,56.83 10,56.2 arc90 10.16,56.04 arc90 10.4,56.28 10.4,56.44 arc-90 10.45,56.49 U2.10
HFXTAL_P
  Top 0.178: U2.11 arc-90 11.71,55.96 11.03,55.96 10.64,55.56 10.64,54.77 10.32,54.45 6.98,54.45 6.83,54.61 6.83,55.16 U$3.3
IOP
  Top 0.178: U2.17 14.49,53.6 12.52,51.63 L2.1
LFXTAL_N
  Top 0.178: U2.35 19.89,60.49 20.41,59.98 Y1.P$1
LFXTAL_P
  Top 0.178: U2.36 19.76,60.99 20.29,61.52 20.4,61.63 Y1.P$2
N$3
  Top 0.178: L2.2 12.52,48.03 13.11,47.43 14.74,47.43 | 16.23,47.43 14.74,47.43 | R9.1 14.72,47.46 14.74,47.43
  Top 0.203: C10.2 16.61,47.82 16.23,47.43
N$23  (via drill 0.38)
  Top 0.178: L4.1 15.49,70.17 15.56,70.09 15.56,70.11 v15.63,70.18 | R9.2 14.72,51.19 v14.22,51.69
  Route2 0.178: v14.22,51.69 14.22,50.87 16.25,48.84 24.88,48.84 28.08,52.03 28.08,56.79 28.01,56.86
  Route2 0.203: v15.63,70.18 15.63,69.62 19.05,66.2 19.05,63.74 20.56,62.23 21.91,62.23 26.43,66.75 27.31,66.75 28.02,66.04 28.02,56.86 28.01,56.86
N$26
  Top 0.406: L4.2 13.25,70.19 E1.ANT
N$49
  Top 0.203: R7.1 L1.2
PAVDD  (via drill 0.38)
  Top 0.178: U2.18 14.99,53.3 15.21,53.07 15.24,53.05 | FB2.2 25.14,67.41 | 25.14,67.41 C13.1 C14.1 | R8.2 | R8.2 25.14,65.52 25.14,67.41 | v26.52,65.46 R8.2
  Top 0.203: v15.24,53.1 15.21,53.07
  Route2 0.178: v26.52,65.46 26.52,63.5 16.12,53.1 v15.24,53.1
PROBE1  (via drill 0.35)
  Top 0.406: Q1.1 23.97,42.78 v24.77,41.99
  other vias: 23.42,41.99 26.11,41.99 27.46,41.99 28.81,41.99 24.77,40.32 26.19,40.32 28.89,40.4 23.34,40.32 27.54,40.32 24.77,38.66 26.19,38.66 28.89,38.73 23.34,38.66 27.54,38.66 24.77,36.67 26.19,36.67 28.89,36.75 23.34,36.67 27.54,36.67 24.77,35.08 26.19,35.08 28.89,35.16 23.34,35.08 27.54,35.08 24.77,33.1 26.19,33.1 28.89,33.18 23.34,33.1 27.54,33.1 24.77,31.43 26.19,31.43 28.89,31.51 23.34,31.43 27.54,31.43 24.77,29.45 26.19,29.45 28.89,29.53 23.34,29.45 27.54,29.45 24.69,27.78 26.11,27.78 28.81,27.86 23.26,27.78 27.46,27.78 24.69,25.8 26.11,25.8 28.81,25.88 23.26,25.8 27.46,25.8 24.69,24.13 26.11,24.13 28.81,24.21 23.26,24.13 27.46,24.13 24.69,22.15 26.11,22.15 28.81,22.23 23.26,22.15 27.46,22.15 24.69,20.56 26.11,20.56 28.81,20.64 23.26,20.56 27.46,20.56 24.69,18.57 26.11,18.57 28.81,18.65 23.26,18.57 27.46,18.57 24.69,16.91 26.11,16.91 28.81,16.99 23.26,16.91 27.46,16.91 24.69,14.92 26.11,14.92 28.81,15 23.26,14.92 27.46,14.92 24.69,8.18 26.11,8.18 27.46,8.18 24.69,13.33 26.11,13.33 28.81,13.41 23.26,13.33 27.46,13.33 24.69,11.67 26.11,11.67 28.81,11.75 23.26,11.67 27.46,11.67 24.69,9.68 26.11,9.68 28.81,9.76 23.26,9.68 27.46,9.68 24.77,6.67 26.19,6.67 27.54,6.67 24.77,5.16 26.19,5.16 27.54,5.16 23.26,8.18 28.89,8.18 25.56,3.73 26.91,3.73 26.27,2.46
  pour Top: 22.29,44.72 22.29,0.27 29.91,0.27 29.91,44.72
  pour Bottom (isolate 0.305): 22.29,44.72 22.29,0.27 29.91,0.27 29.91,44.72
PROBE2  (via drill 0.35)
  Top 0.254: R2.1 6.45,47.31 2.46,43.32 v2.46,41.91 | 2.46,41.5 v2.46,39.93 | 2.46,39.83 v2.46,38.26 | 2.46,37.85 v2.46,36.27 | 2.46,36.1 v2.46,34.69 | 2.46,34.27 v2.46,32.7 | 2.46,32.61 v2.46,31.04 | 2.46,30.62 v2.46,29.05 | 2.38,28.8 v2.38,27.38 | 2.38,26.97 v2.38,25.4 | 2.38,25.3 v2.38,23.73 | 2.38,23.32 v2.38,21.75 | 2.38,21.57 v2.38,20.16 | 2.38,19.75 v2.38,18.18 | 2.38,18.08 v2.38,16.51 | 2.38,16.1 v2.38,14.53 | 2.38,9.35 v2.38,7.78 | 2.38,14.51 v2.38,12.94 | 2.38,12.84 v2.38,11.27 | 2.38,10.86 v2.38,9.29 | 2.46,7.84 v2.46,6.27 | 2.46,6.33 v2.46,4.76
  other vias: 3.89,41.91 6.59,41.99 1.03,41.91 5.24,41.91 3.89,39.93 6.59,40 1.03,39.93 5.24,39.93 3.89,38.26 6.59,38.34 1.03,38.26 5.24,38.26 3.89,36.27 6.59,36.35 1.03,36.27 5.24,36.27 3.89,34.69 6.59,34.77 1.03,34.69 5.24,34.69 3.89,32.7 6.59,32.78 1.03,32.7 5.24,32.7 3.89,31.04 6.59,31.12 1.03,31.04 5.24,31.04 3.89,29.05 6.59,29.13 1.03,29.05 5.24,29.05 3.81,27.38 6.51,27.46 0.95,27.38 5.16,27.38 3.81,25.4 6.51,25.48 0.95,25.4 5.16,25.4 3.81,23.73 6.51,23.81 0.95,23.73 5.16,23.73 3.81,21.75 6.51,21.83 0.95,21.75 5.16,21.75 3.81,20.16 6.51,20.24 0.95,20.16 5.16,20.16 3.81,18.18 6.51,18.26 0.95,18.18 5.16,18.18 3.81,16.51 6.51,16.59 0.95,16.51 5.16,16.51 3.81,14.53 6.51,14.6 0.95,14.53 5.16,14.53 3.81,7.78 5.16,7.78 3.81,12.94 6.51,13.02 0.95,12.94 5.16,12.94 3.81,11.27 6.51,11.35 0.95,11.27 5.16,11.27 3.81,9.29 6.51,9.37 0.95,9.29 5.16,9.29 3.89,6.27 5.24,6.27 3.89,4.76 5.24,4.76 0.95,7.78 6.59,7.78 3.25,3.33 4.6,3.33 3.97,2.06
  pour Top: 0,44.45 0,0 7.62,0 7.62,44.45
  pour Bottom: 0,44.45 0,0 7.62,0 7.62,44.45
RADIO_RESET
  Top 0.203: U2.12 11.74,54.51 10.56,53.34 5.07,53.34 4.12,54.29 U$5.10
RFVDD
  Top 0.178: FB1.2 C11.1 C12.1 4.47,61.04 5.24,61.04 5.56,60.72 5.56,58.1 6.27,57.39 8.02,57.39 8.41,57.78 10.08,57.78 10.87,56.99 U2.9
SCL
  Top 0.178: U$2.COM2 7.01,63.72 7.55,63.17 TP2.P$1 11.82,62.79 12.73,62.79
  Top 0.203: U2.47 12.99,62.54 12.73,62.79
SCL_IN  (via drill 0.38, 0.4)
  Top 0.178: R6.1 12.8,64.93 TP1.P$1 12.06,64.19 U$1.4 10.91,63.74 8.41,63.74 8.24,63.92 v8.15,63.92
  Top 0.203: U$2.NO2 6.61,63.22 6.61,63.21 6.12,62.72 v6.12,61.63 | v4.58,63.82 4.57,63.8 U1.SCL
  Route2 0.178: v4.58,63.82 4.58,63.17 5.22,62.53 | 5.22,62.53 v6.12,61.63 | v8.15,63.92 6.61,63.92 5.22,62.53
SDA  (via drill 0.38)
  Top 0.178: 12.38,62.36 7.35,62.36 v7.22,62.23 | TP4.P$1 7.17,68.26 v10.08,68.26
  Top 0.203: TP4.P$1 6.61,67.6 U$2.COM4 | U2.48 12.49,62.24 12.38,62.36
  Route15 0.178: v7.22,62.23 7.77,62.23 7.89,62.34 8.5,62.34 8.61,62.23 8.89,62.23 10.08,63.42
  Route15 0.203: 10.08,63.42 10.32,63.42 11.91,65.01 11.91,67.87 11.51,68.26 v10.08,68.26
SDA_IN
  Top 0.178: U1.SDA 3.39,67.33 3.01,67.71 3.01,68.34 | TP3.P$1 8.18,70.72 3.41,70.72 3.01,70.32 3.01,68.34 | U$2.NO4 6.2,66.7 5.79,67.11 5.79,67.95 5.4,68.34 3.01,68.34
  Top 0.203: U1.SDA 3.39,66.89 | R5.1 8.35,69.18 8.38,69.2 10.68,69.2 11.37,68.52 U$1.6
  Top 0.406: R5.1 8.31,70.75 TP3.P$1
SENSOR_ENABLE  (via drill 0.38)
  Top 0.178: R10.2 TP5.P$1 20.95,51.43 17.99,54.4 U2.24 | 5.79,65.57 6.42,65.57 6.84,65.15 7.38,65.15 | 5.79,65.57 U$2.IN1 5.81,65.64 U$2.IN4 | U$2.IN3 7.38,65.15 | U$2.IN2 7.41,65.13 7.38,65.15 | U$2.IN4 5.81,65.58 5.79,65.57 | U$2.IN4 5.69,66.36 v4.6,66.36
  Top 0.203: TP5.P$1 21.43,51.59 22.94,53.1 v22.94,53.18
  Route2 0.178: v4.6,66.36 13.1,66.36 17.94,61.52 v22.94,61.52
  Route15 0.203: v22.94,53.18 v22.94,61.52
SIG
  Top 0.178: U2.25 22.95,55.49 27.28,51.16 27.28,50.01
  Top 0.406: R1.2 28.04,50.01 27.28,50.01 26.67,50.01 25.88,49.21 Q1.2
SOIL_MOIST_PWR
  Top 0.178: Q1.3 23.75,50.31 23.08,49.65 23.08,47.59 22.52,47.02 22.43,46.93 | U2.20 15.99,53.87 17.65,52.21 17.65,47.83
  Top 0.203: R2.2 10.83,49.01 13.1,46.75 17.62,46.75 | 22.52,47.02 22.25,46.75 17.62,46.75 | 17.65,47.83 17.65,46.78 17.62,46.75
TCK  (via drill 0.38)
  Top 0.178: U2.1 9.17,60.99 | 9.17,60.99 9.16,60.98 | 9.17,60.99 8.58,61.59 8.21,61.59 v8.19,61.61 | v0.95,50.42 2,50.42 U$5.4
  Route2 0.178: 0.71,50.63 0.93,50.42 v0.95,50.42 7.56,50.42 12.7,55.56 12.7,59.37 11.43,60.64 9.16,60.64 v8.19,61.61
TDI  (via drill 0.38)
  Top 0.178: U2.4 9.48,59.49 8.33,58.34 v7.14,58.34 | U$5.8 3.73,51.75 4.6,52.63 6.98,52.63 7.22,52.39 7.14,52.31 v7.14,51.75
  Route2 0.178: v7.14,58.34 v7.14,51.75
TDO  (via drill 0.38)
  Top 0.178: U2.3 9.03,59.99 8.41,59.37 8.01,59.37 | 7.94,59.37 8.01,59.37 | v6.51,59.45 6.42,59.37 8.01,59.37 | v5.48,51.51 5.72,51.51 6.98,50.24 6.98,48.66 6.59,48.26 5,48.26 4.05,49.21 U$5.6
  Route2 0.178: v6.51,59.45 5.79,59.45 4.84,58.5 4.84,52.15 v5.48,51.51
TMS  (via drill 0.38)
  Top 0.178: v0.87,52.94 1.98,52.94 U$5.2
  Top 0.203: U2.2 v7.56,60.49
  Route2 0.178: v7.56,60.49 7.47,60.4 4.6,60.4 3.97,59.77 3.97,55.09 1.98,53.1 1.98,53.02 1.91,52.94 v0.87,52.94
V_BATT  (via drill 0.38)
  Top 0.178: 7.01,66.93 7.54,67.47 v8.33,67.47
  Top 0.203: C5.1 C4.1 v23.49,65.96 | U2.42 15.49,61.11 15.59,61.01 16.8,61.01 16.99,61.2 U2.39 16.99,63.09 C6.1 17.54,63.64 v17.54,64.69 | L1.1 26.77,53.63 v26.83,53.58 | U$2.COM3 7.01,66.93 | U$2.COM1 6.21,65.02 | 6.21,65.02 6.27,65.09 | 6.21,65.02 6.1,65.02 6.03,65.09 5.76,65.09 U$2.VCC 4.81,65.12 v4.68,65.25
  Route15 0.203: v17.54,64.69 17.54,65.01 | v26.83,53.58 26.83,53.34 | v23.49,65.96 23.49,65.72
  Bottom 0.508: BT1.1 4.24,55.93 v5.79,54.37 5.87,54.29
  pour Route15: 0,71.44 29.84,71.44 29.84,46.04 0,46.04
VDCDC  (via drill 0.38)
  Top 0.178: R8.1 25.07,63.75 23.82,63.75 21.32,66.24 L3.P$2 18.99,66.3 C7.1 C8.2
  Top 0.203: 14.42,66.28 C8.2 | FB1.1 1.98,58.6 1.98,58.02 v2.14,57.86 | v16.03,65.01 C7.1
  Route2 0.203: v2.14,57.86 2.38,57.86 2.54,58.02 2.54,67.55 3.27,68.28 8.35,68.28 9.13,69.06 13.57,69.06 16.03,66.6 v16.03,65.01
VDD  (via drill 0.38)
  Top 0.178: v5.22,69.23 5.19,69.23 5.17,69.21
  Top 0.203: U$2.NO1 5.81,63.21 5.13,62.53 v3.73,62.53 3.25,62.53 2.37,63.41 U1.VCC | FB2.1 25.08,69.53 v26.11,70.56 | R11.2 19.84,50.96 19.76,51.04 v19.76,51.2 | v0.95,55.32 1.98,54.29 U$5.1 | 9.02,65.93 U$1.1 | R6.2 12.8,68.92 13.1,69.21 16.59,69.21 17.22,69.85 v17.22,70.48 | U$2.NO3 8.71,66.24 9.02,65.93 | 9.02,65.93 10.08,66.99 v10.08,67.09
  Top 0.406: C1.1 5.17,69.21 R5.2
  Route2 0.203: v5.22,69.23 4.28,70.17 3.25,70.17 1.35,68.26 1.35,55.8 0.95,55.4 v0.95,55.32 | v10.08,67.09 10.08,66.91
  Route15 0.203: 8.89,69.23 v5.22,69.23 3.73,67.75 v3.73,62.53 | 8.89,69.23 17.22,69.23 | 17.22,69.23 24.78,69.23 v26.11,70.56 | v19.76,51.2 15.8,51.2 14.92,50.32 3.41,50.32 2.62,51.12 2.62,53.5 1.03,55.09 1.03,55.24 v0.95,55.32 | v17.22,70.48 17.22,69.23 | v10.08,67.09 10.08,67.15 8.89,68.34 8.89,69.23
VREGSW  (via drill 0.38)
  Top 0.203: U2.38 17.49,62.25 17.74,62.5 19.92,62.5 20.95,63.53 v20.95,63.82
  Top 0.406: L3.P$1 19.05,70.17 v18.73,70.48
  Route2 0.203: v20.95,63.82 20.95,68.34 18.81,70.48 v18.73,70.48

### Text on the board
Bottom: V02
tPlace: 3 | LIGHT | TEMP